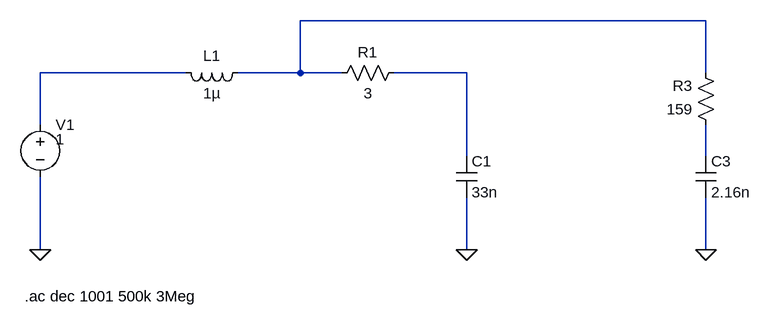
[diagram p0: schematic pwm_filter.asc]
pwm_filter.asc, the LTspice schematic file:
Version 4
SHEET 1 1164 680
WIRE 1088 144 464 144
WIRE 288 224 64 224
WIRE 464 224 464 144
WIRE 464 224 368 224
WIRE 528 224 464 224
WIRE 720 224 608 224
WIRE 1088 224 1088 144
WIRE 64 304 64 224
WIRE 720 352 720 224
WIRE 1088 352 1088 304
WIRE 64 496 64 384
WIRE 720 496 720 416
WIRE 1088 496 1088 416
FLAG 64 496 0
FLAG 720 496 0
FLAG 1088 496 0
SYMBOL voltage 64 288 R0
WINDOW 3 24 38 Left 2
SYMATTR Value 1
SYMATTR InstName V1
SYMATTR Value2 AC 1 0
SYMBOL ind 384 208 R90
WINDOW 0 5 56 VBottom 2
WINDOW 3 32 56 VTop 2
SYMATTR InstName L1
SYMATTR Value 1µ
SYMBOL cap 704 352 R0
SYMATTR InstName C1
SYMATTR Value 33n
SYMBOL res 624 208 R90
WINDOW 0 0 56 VBottom 2
WINDOW 3 32 56 VTop 2
SYMATTR InstName R1
SYMATTR Value 3
SYMBOL res 1104 320 R180
WINDOW 0 36 76 Left 2
WINDOW 3 36 40 Left 2
SYMATTR InstName R3
SYMATTR Value 159
SYMBOL cap 1072 352 R0
SYMATTR InstName C3
SYMATTR Value 2.16n
TEXT 40 568 Left 2 !.ac dec 1001 500k 3Meg

The netlist it stands for:
* pwm_filter.asc
V1 N002 0 1 AC 1 0
L1 N001 N002 1µ
C1 N003 0 33n
R1 N003 N001 3
R3 N004 N001 159
C3 N004 0 2.16n
.ac dec 1001 500k 3Meg
.backanno
.end